# Altium project SPCE061Aserial.PrjPCB
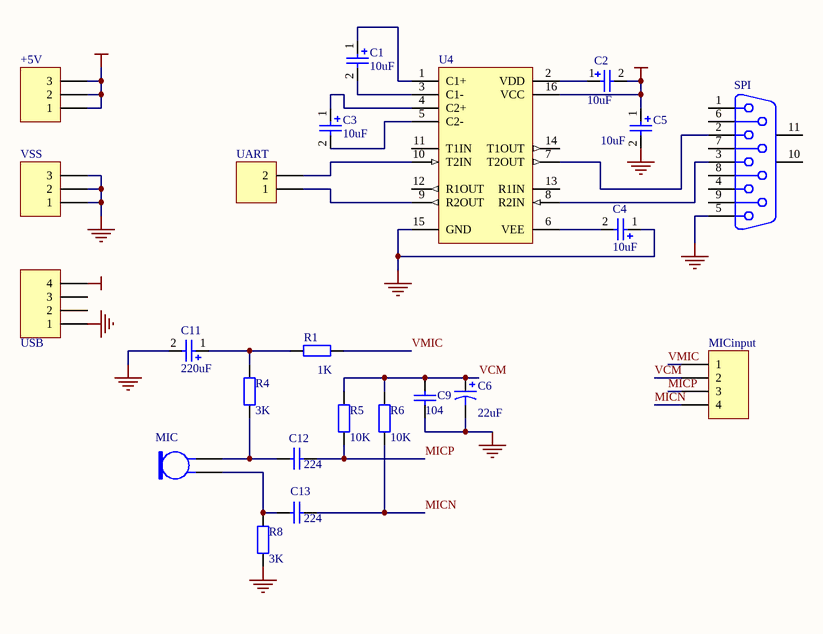
[diagram p0: 原理图.SchDoc]
1 sheet, 23 parts. Net scope: global (net labels, ports and power ports of the same name join across sheets).
Board file: 凌阳外围系统.PcbDoc

## Sheet 原理图.SchDoc
size A4

### Parts
+5V  PZ_3  [HDR-3]  (value not drawn)
C1  value 10uF  [DJDR_4mm]  (hidden comment: DJDR)
C2  value 10uF  [DJDR_4mm]  (hidden comment: DJDR)
C3  value 10uF  [DJDR_4mm]  (hidden comment: DJDR)
C4  value 10uF  [DJDR_4mm]  (hidden comment: DJDR)
C5  value 10uF  [DJDR_4mm]  (hidden comment: DJDR)
C6  value 22uF  [C-DJ-4]  (hidden comment: Cap Pol1)
C9  value 104  [CPDR]  (hidden comment: Cap)
C11  value 220uF  [DJDR_4mm]  (hidden comment: DJDR)
C12  value 224  [CPDR]  (hidden comment: Cap)
C13  value 224  [CPDR]  (hidden comment: Cap)
MIC  MKF  [HDR-2]  (value not drawn)
MICinput  PZ_4  [HDR-4]  (value not drawn)
R1  value 1K  [RSE]  (hidden comment: Res2)
R4  value 3K  [RSE]  (hidden comment: Res2)
R5  value 10K  [RSE]  (hidden comment: Res2)
R6  value 10K  [RSE]  (hidden comment: Res2)
R8  value 3K  [RSE]  (hidden comment: Res2)
SPI  CKT_9  [COM-9]  (value not drawn)
U4  MAX232ACPE  [DIP-16]  (value not drawn)
UART  PZ_2  [HDR-2]  (value not drawn)
USB  PZ_4  [USB - duplicate]  (value not drawn)
VSS  PZ_3  [HDR-3]  (value not drawn)

### Nets
GND: C4.1 C5.2 C6.2 C9.1 C11.2 R8.1 SPI.5 U4.15(GND) USB.1 VSS.1 VSS.2 VSS.3
VCC: +5V.1 +5V.2 +5V.3 C2.2 C5.1 U4.16(VCC) USB.4
MICN: C13.2 MICinput.4 R6.1
MICP: C12.2 MICinput.3 R5.1
VCM: C6.1 C9.2 MICinput.2 R5.2 R6.2
VMIC: MICinput.1 R1.2
NetC1_1: C1.1 U4.1(C1+)
NetC1_2: C1.2 U4.3(C1-)
NetC2_1: C2.1 U4.2(VDD)
NetC3_1: C3.1 U4.4(C2+)
NetC3_2: C3.2 U4.5(C2-)
NetC4_2: C4.2 U4.6(VEE)
NetC11_1: C11.1 R1.1 R4.2
NetC12_1: C12.1 MIC.1(+) R4.1
NetC13_1: C13.1 MIC.2 R8.2
NetSPI_2: SPI.2 U4.7(T2OUT)
NetSPI_3: SPI.3 U4.8(R2IN)
NetU4_9: U4.9(R2OUT) UART.1
NetU4_10: U4.10(T2IN) UART.2

Not connected (* = marked no-connect by the designer): SPI 1 4 6 7 8 9 10(MH1) 11(MH2); U4 11(T1IN) 12(R1OUT) 13(R1IN) 14(T1OUT); USB 2 3

### Library data of the parts
+5V VSS = PZ_3: 排针——3; LatestRevisionDate: 17-Jul-2002; LatestRevisionNote: Re-released for DXP Platform.; Publisher: Altium Limited
C1-C5 C11 = DJDR: 电解电容; Published: 8-Jun-2000; LatestRevisionDate: 17-Jul-2002; LatestRevisionNote: Re-released for DXP Platform.; Publisher: Altium Limited
C6 = Cap Pol1: Polarized Capacitor (Radial); Published: 8-Jun-2000; LatestRevisionDate: 17-Jul-2002; LatestRevisionNote: Re-released for DXP Platform.; Publisher: Altium Limited
C9 C12 C13 = Cap: Capacitor; Published: 8-Jun-2000; LatestRevisionDate: 17-Jul-2002; LatestRevisionNote: Re-released for DXP Platform.; Publisher: Altium Limited
MIC = MKF: 麦克风; Published: 24-Mar-1999; LatestRevisionDate: 17-Jul-2002; LatestRevisionNote: Re-released for DXP Platform.; Publisher: Altium Limited
MICinput USB = PZ_4: 排针——4; LatestRevisionDate: 17-Jul-2002; LatestRevisionNote: Re-released for DXP Platform.; Publisher: Altium Limited
R1 R4-R6 R8 = Res2: Resistor; Published: 8-Jun-2000; LatestRevisionDate: 17-Jul-2002; LatestRevisionNote: Re-released for DXP Platform.; Publisher: Altium Limited
SPI = CKT_9: 9针串口头_母; PackageDocument: O; Positions: 9; Gender: Receptacle; Published: 15-Jun-2001; LatestRevisionDate: 17-Jul-2002; LatestRevisionNote: Re-released for DXP Platform.; DatasheetDocument: 1-Sep-1999; PackageReference: 788750; Publisher: Altium Limited; Orientation: Right Angle
U4 = MAX232ACPE: +5V Powered, Multi-Channel RS-232 Driver/Receiver; PackageDocument: 1997; Published: 16-Jan-2001; LatestRevisionDate: 6-Jun-2005; LatestRevisionNote: Stylized 3D Model Added.; PackageReference: PE16A; Publisher: Altium Limited; Code_JEDEC: MS-001-BB; ComponentLink1Description: Manufacturer Link; ComponentLink1URL: http://www.maxim-ic.com/; ComponentLink2Description: Datasheet; ComponentLink2URL: http://pdfserv.maxim-ic.com/en/ds/MAX220-MAX249.pdf
UART = PZ_2: 排针——2; LatestRevisionDate: 17-Jul-2002; LatestRevisionNote: Re-released for DXP Platform.; Publisher: Altium Limited